# Altium schematic sheet A3010_Adelaide_8MB_IDE_RAM.SchDoc
size A3; SheetNumber: 2; SheetTotal: 3
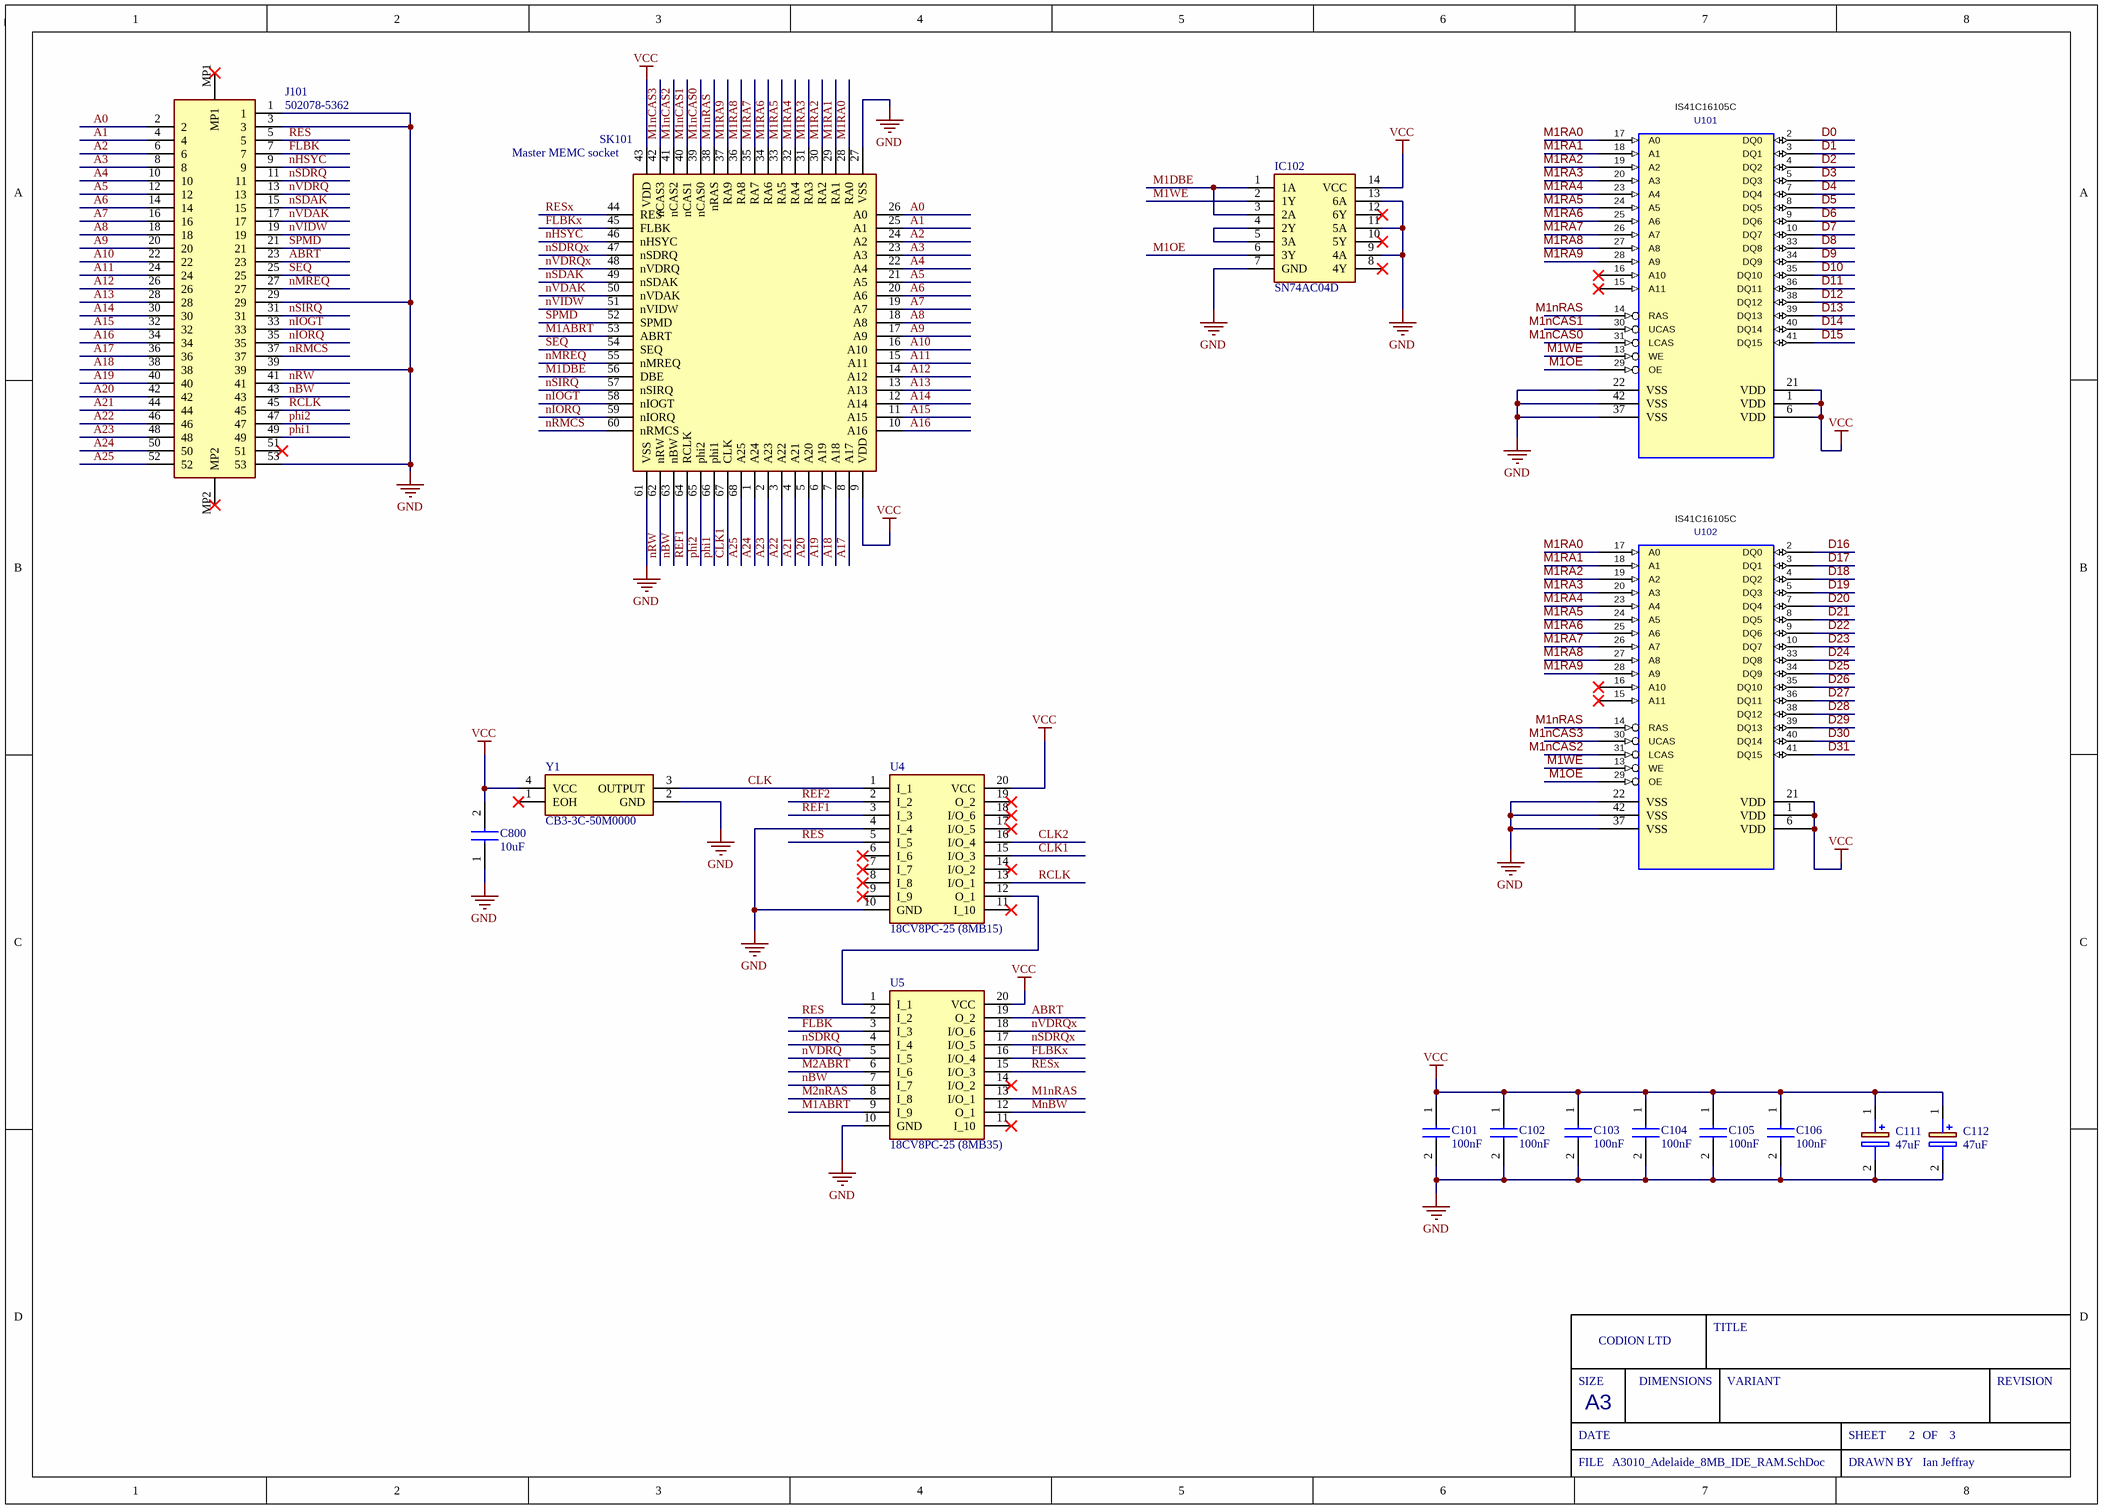
[diagram p0: A3010_Adelaide_8MB_IDE_RAM.SchDoc]

## Parts
C101  100nF  [CAPC2012X145N]
C102  100nF  [CAPC2012X145N]
C103  100nF  [CAPC2012X145N]
C104  100nF  [CAPC2012X145N]
C105  100nF  [CAPC2012X145N]
C106  100nF  [CAPC2012X145N]
C111  47uF  [EEE1AA101SP]
C112  47uF  [EEE1AA101SP]
C800  10uF  [CAPC1005X55N]
IC102  SN74AC04D  [SOIC127P600X175-14N]
J101  502078-5362  [5020785362]
SK101  Master MEMC socket  [MEMC_Socket]
U4  18CV8PC-25 (8MB15)  [DIP762W66P254L2692H508Q20N]
U5  18CV8PC-25 (8MB35)  [DIP762W66P254L2692H508Q20N]
U101  IS41C16105C  [SOJ-42]
U102  IS41C16105C  [SOJ-42]
Y1  CB3-3C-50M0000  [CB33C50M0000]

## Nets
GND: C101.2 C102.2 C103.2 C104.2 C105.2 C106.2 C111.2(-) C112.2(-) C800.1 IC102.7(GND) IC102.9(4A) IC102.11(5A) IC102.13(6A) J101.1 J101.3 J101.29 J101.39 J101.53 SK101.27(VSS) SK101.61(VSS) U4.4(I_4) U4.10(GND) U5.10(GND) U101.22(VSS) U101.37(VSS) U101.42(VSS) U102.22(VSS) U102.37(VSS) U102.42(VSS) Y1.2(GND)
VCC: C101.1 C102.1 C103.1 C104.1 C105.1 C106.1 C111.1(+) C112.1(+) C800.2 IC102.14(VCC) SK101.9(VDD) SK101.43(VDD) U4.20(VCC) U5.20(VCC) U101.1(VCC) U101.6(VCC) U101.21(VCC) U102.1(VCC) U102.6(VCC) U102.21(VCC) Y1.4(VCC)
A0: J101.2 SK101.26(A0)
A1: J101.4 SK101.25(A1)
A2: J101.6 SK101.24(A2)
A3: J101.8 SK101.23(A3)
A4: J101.10 SK101.22(A4)
A5: J101.12 SK101.21(A5)
A6: J101.14 SK101.20(A6)
A7: J101.16 SK101.19(A7)
A8: J101.18 SK101.18(A8)
A9: J101.20 SK101.17(A9)
A10: J101.22 SK101.16(A10)
A11: J101.24 SK101.15(A11)
A12: J101.26 SK101.14(A12)
A13: J101.28 SK101.13(A13)
A14: J101.30 SK101.12(A14)
A15: J101.32 SK101.11(A15)
A16: J101.34 SK101.10(A16)
A17: J101.36 SK101.8(A17)
A18: J101.38 SK101.7(A18)
A19: J101.40 SK101.6(A19)
A20: J101.42 SK101.5(A20)
A21: J101.44 SK101.4(A21)
A22: J101.46 SK101.3(A22)
A23: J101.48 SK101.2(A23)
A24: J101.50 SK101.1(A24)
A25: J101.52 SK101.68(A25)
ABRT: J101.23 U5.19(O_2)
CLK: U4.1(I_1) Y1.3(OUTPUT)
CLK1: SK101.67(CLK) U4.15(I/O_3)
CLK2: U4.16(I/O_4)
D0: U101.2(DQ0)
D1: U101.3(DQ1)
D2: U101.4(DQ2)
D3: U101.5(DQ3)
D4: U101.7(DQ4)
D5: U101.8(DQ5)
D6: U101.9(DQ6)
D7: U101.10(DQ7)
D8: U101.33(DQ8)
D9: U101.34(DQ9)
D10: U101.35(DQ10)
D11: U101.36(DQ11)
D12: U101.38(DQ12)
D13: U101.39(DQ13)
D14: U101.40(DQ14)
D15: U101.41(DQ15)
D16: U102.2(DQ0)
D17: U102.3(DQ1)
D18: U102.4(DQ2)
D19: U102.5(DQ3)
D20: U102.7(DQ4)
D21: U102.8(DQ5)
D22: U102.9(DQ6)
D23: U102.10(DQ7)
D24: U102.33(DQ8)
D25: U102.34(DQ9)
D26: U102.35(DQ10)
D27: U102.36(DQ11)
D28: U102.38(DQ12)
D29: U102.39(DQ13)
D30: U102.40(DQ14)
D31: U102.41(DQ15)
FLBK: J101.7 U5.3(I_3)
FLBKx: SK101.45(FLBK) U5.16(I/O_4)
M1ABRT: SK101.53(ABRT) U5.9(I_9)
M1DBE: IC102.1(1A) IC102.3(2A) SK101.56(DBE)
M1nCAS0: SK101.39(nCAS0) U101.31(LCAS)
M1nCAS1: SK101.40(nCAS1) U101.30(UCAS)
M1nCAS2: SK101.41(nCAS2) U102.31(LCAS)
M1nCAS3: SK101.42(nCAS3) U102.30(UCAS)
M1nRAS: SK101.38(nRAS) U5.13(I/O_1) U101.14(RAS) U102.14(RAS)
M1OE: IC102.6(3Y) U101.29(OE) U102.29(OE)
M1RA0: SK101.28(RA0) U101.17(A0) U102.17(A0)
M1RA1: SK101.29(RA1) U101.18(A1) U102.18(A1)
M1RA2: SK101.30(RA2) U101.19(A2) U102.19(A2)
M1RA3: SK101.31(RA3) U101.20(A3) U102.20(A3)
M1RA4: SK101.32(RA4) U101.23(A4) U102.23(A4)
M1RA5: SK101.33(RA5) U101.24(A5) U102.24(A5)
M1RA6: SK101.34(RA6) U101.25(A6) U102.25(A6)
M1RA7: SK101.35(RA7) U101.26(A7) U102.26(A7)
M1RA8: SK101.36(RA8) U101.27(A8) U102.27(A8)
M1RA9: SK101.37(RA9) U101.28(A9) U102.28(A9)
M1WE: IC102.2(1Y) U101.13(WE) U102.13(WE)
M2ABRT: U5.6(I_6)
M2nRAS: U5.8(I_8)
MnBW: U5.12(O_1)
nBW: J101.43 SK101.63(nBW) U5.7(I_7)
nHSYC: J101.9 SK101.46(nHSYC)
nIOGT: J101.33 SK101.58(nIOGT)
nIORQ: J101.35 SK101.59(nIORQ)
nMREQ: J101.27 SK101.55(nMREQ)
nRMCS: J101.37 SK101.60(nRMCS)
nRW: J101.41 SK101.62(nRW)
nSDAK: J101.15 SK101.49(nSDAK)
nSDRQ: J101.11 U5.4(I_4)
nSDRQx: SK101.47(nSDRQ) U5.17(I/O_5)
nSIRQ: J101.31 SK101.57(nSIRQ)
nVDAK: J101.17 SK101.50(nVDAK)
nVDRQ: J101.13 U5.5(I_5)
nVDRQx: SK101.48(nVDRQ) U5.18(I/O_6)
nVIDW: J101.19 SK101.51(nVIDW)
phi1: J101.49 SK101.66(phi1)
phi2: J101.47 SK101.65(phi2)
RCLK: J101.45 U4.13(I/O_1)
REF1: SK101.64(RCLK) U4.3(I_3)
REF2: U4.2(I_2)
RES: J101.5 U4.5(I_5) U5.2(I_2)
RESx: SK101.44(RES) U5.15(I/O_3)
SEQ: J101.25 SK101.54(SEQ)
SPMD: J101.21 SK101.52(SPMD)
NetIC102_4: IC102.4(2Y) IC102.5(3A)
NetU4_12: U4.12(O_1) U5.1(I_1)

Not connected (* = marked no-connect by the designer): IC102 8(4Y)* 10(5Y)* 12(6Y)*; J101 51* MP1* MP2*; U4 6(I_6)* 7(I_7)* 8(I_8)* 9(I_9)* 11(I_10)* 14(I/O_2)* 17(I/O_5)* 18(I/O_6)* 19(O_2)*; U5 11(I_10)* 14(I/O_2)*; U101 15(A11)* 16(A10)*; U102 15(A11)* 16(A10)*; Y1 1(EOH)*

## Notes on the sheet
- Ian Jeffray
- SIZE
- CODION LTD
- DIMENSIONS
- TITLE
- VARIANT
- REVISION
- DATE
- A3
- SHEET
- OF
- FILE
- DRAWN BY

## Library data of the parts
C101-C106 = C2012X7R1H104K125AM: Capacitor; Manufacturer_Name: TDK; Datasheet Link: https://product.tdk.com/info/en/catalog/datasheets/mlcc_commercial_midvoltage_en.pdf; Height: 1.45mm; Manufacturer_Part_Number: C2012X7R1H104K125AM; Mouser Part Number: 810-C2012X7R1H104KT5; Mouser Price/Stock: https://www.mouser.com/Search/Refine.aspx?Keyword=810-C2012X7R1H104KT5; Arrow Part Number: C2012X7R1H104K125AM; Arrow Price/Stock: https://www.arrow.com/en/products/c2012x7r1h104k125am/tdk
C111 C112 = EEE1VA470WP: Capacitor Polarised; Manufacturer_Name: Panasonic; Datasheet Link: http://industrial.panasonic.com/cdbs/www-data/pdf/RDE0000/ABA0000C1145.pdf; Height: 7.8mm; Manufacturer_Part_Number: EEE1VA470WP
C800 = GRM155R60E106ME16D: Capacitor; Manufacturer_Name: Murata Electronics; Datasheet Link: http://www.murata.com/~/media/webrenewal/support/library/catalog/products/capacitor/mlcc/c02e.pdf; Height: 0.55mm; Manufacturer_Part_Number: GRM155R60E106ME16D; Mouser Part Number: 81-GRM155R60E106ME6D; Mouser Price/Stock: https://www.mouser.co.uk/ProductDetail/Murata-Electronics/GRM155R60E106ME16D?qs=WjGk7BNrzSEW%252BbCEsPsbOg%3D%3D; Arrow Part Number: GRM155R60E106ME16D; Arrow Price/Stock: https://www.arrow.com/en/products/grm155r60e106me16d/murata-manufacturing
IC102 = SN74AC04D: Integrated Circuit; Manufacturer_Name: Texas Instruments; Datasheet Link: http://www.ti.com/lit/ds/symlink/sn74ac04.pdf; Height: 1.75mm; Manufacturer_Part_Number: SN74AC04D; Mouser Part Number: 595-SN74AC04D; Mouser Price/Stock: https://www.mouser.co.uk/ProductDetail/Texas-Instruments/SN74AC04D?qs=w32V8uFkMxkvsyMHHacuZw%3D%3D; Arrow Part Number: SN74AC04D; Arrow Price/Stock: https://www.arrow.com/en/products/sn74ac04d/texas-instruments?region=nac
J101 = 502078-5362: Connector; Manufacturer_Name: Molex; Datasheet Link: https://componentsearchengine.com/Datasheets/1/502078-5362.pdf; Height: 1.15mm; Manufacturer_Part_Number: 502078-5362; Mouser Part Number: 538-502078-5362; Mouser Price/Stock: https://www.mouser.com/Search/Refine.aspx?Keyword=538-502078-5362
SK101 = MEMC_Skt: MEMC socket; Manufacturer_Name: 3M; Manufacturer_Part_Number: 8468-21B1-RK-TR; Datasheet Link: https://www.arrow.com/en/products/8468-21b1-rk-tr/3m; Height: 4.6mm; Mouser Part Number: 517-8468-21B1-RK-TR; Mouser Price/Stock: https://www.mouser.co.uk/ProductDetail/3M-Electronic-Solutions-Division/8468-21B1-RK-TR?qs=X%2F%2F06fXhnJ18zOj3KK47CQ%3D%3D; Arrow Part Number: 8468-21B1-RK-TR; Arrow Price/Stock: https://www.arrow.com/en/products/8468-21b1-rk-tr/3m
U4 U5 = PAL16R4AMJ: Integrated Circuit; Manufacturer_Name: Texas Instruments; Datasheet Link: http://www.ti.com/lit/ds/symlink/pal16r4am.pdf; Height: 5.08mm; Manufacturer_Part_Number: PAL16R4AMJ; Mouser Part Number: 595-PAL16R4AMJ; Mouser Price/Stock: https://www.mouser.com/Search/Refine.aspx?Keyword=595-PAL16R4AMJ
U101 U102 = DRAM_1MX16_SOJ: Value: IS41C16105C
Y1 = CB3-3C-50M0000: Crystal or Oscillator; Manufacturer_Name: CTS; Datasheet Link: https://www.arrow.com/en/products/cb3-3c-50m0000/cts; Height: 1.8mm; Manufacturer_Part_Number: CB3-3C-50M0000; Mouser Part Number: 774-CB3-3C-50M0; Mouser Price/Stock: https://www.mouser.co.uk/ProductDetail/CTS-Electronic-Components/CB3-3C-50M0000/?qs=HL%252BYNjdyZ0t9%2FwogPxCGyA%3D%3D; Arrow Part Number: CB3-3C-50M0000; Arrow Price/Stock: https://www.arrow.com/en/products/cb3-3c-50m0000/cts